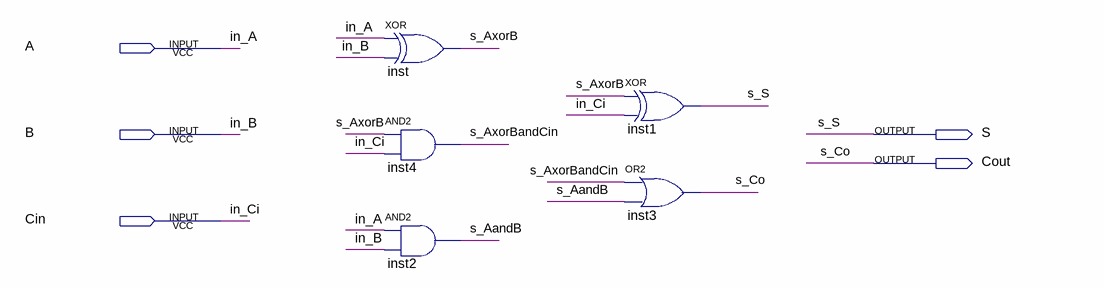
[diagram p0: schematic sheet]
// Quartus schematic fullsum.bdf as structural Verilog: 5 symbols, 5 pins
module fullsum (
  input  A,
  input  B,
  input  Cin,
  output S,
  output Cout
);

  wire s_AandB, s_AxorB, s_AxorBandCin;

  xor inst (s_AxorB, A, B);
  and inst4 (s_AxorBandCin, s_AxorB, Cin);
  and inst2 (s_AandB, A, B);
  xor inst1 (S, s_AxorB, Cin);
  or inst3 (Cout, s_AxorBandCin, s_AandB);

  // Other names for the same wires on the sheet: in_A = A; in_B = B; in_Ci = Cin; s_Co = Cout; s_S = S
endmodule
